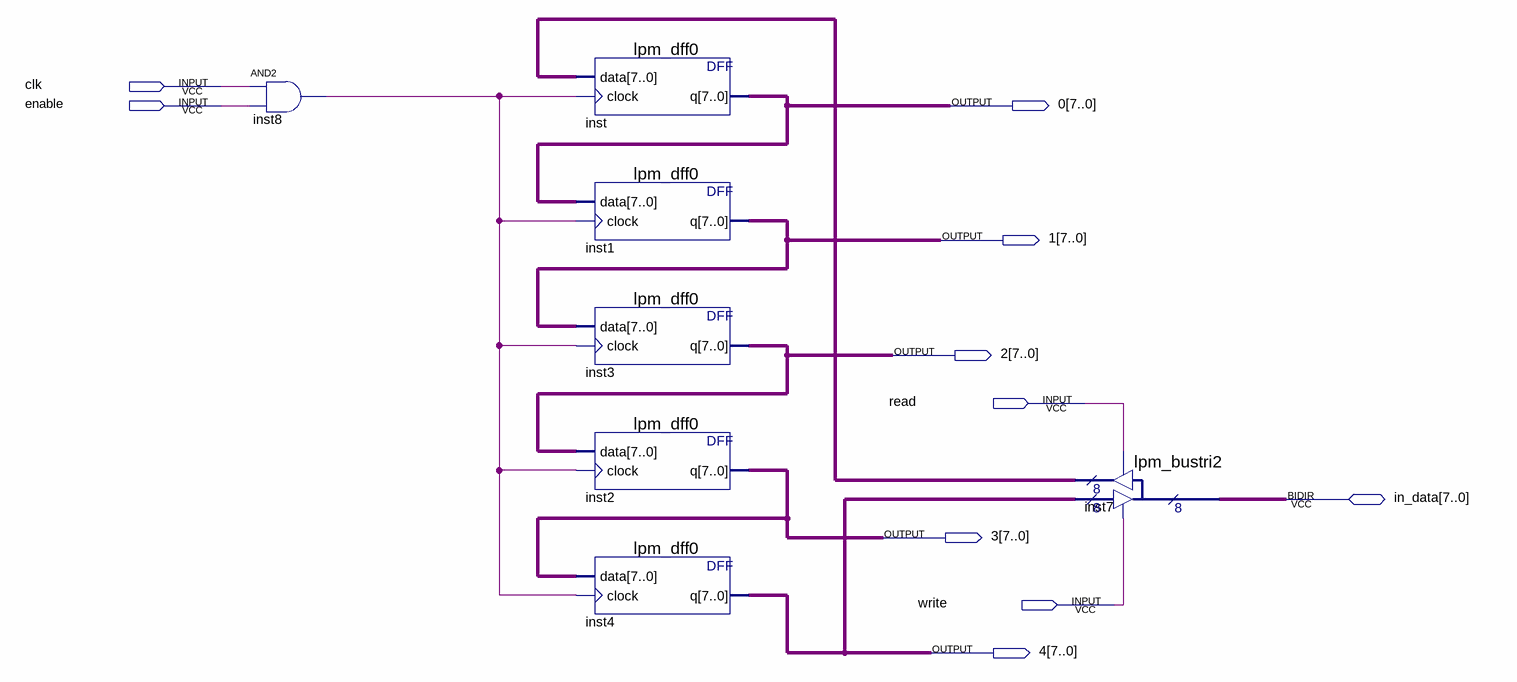
[diagram p0: schematic sheet]
// Quartus schematic buffer.bdf as structural Verilog: 7 symbols, 10 pins
module buffer (
  input  clk,
  input  enable,
  input  read,
  input  write,
  inout  [7:0] in_data,
  output [7:0] \0 ,
  output [7:0] \1 ,
  output [7:0] \2 ,
  output [7:0] \3 ,
  output [7:0] \4 
);

  wire inst8_out;
  wire [7:0] inst7_result;

  and inst8 (inst8_out, clk, enable);
  lpm_dff0 inst (.data(inst7_result), .clock(inst8_out), .q(\0 ));
  lpm_dff0 inst1 (.data(\0 ), .clock(inst8_out), .q(\1 ));
  lpm_dff0 inst3 (.data(\1 ), .clock(inst8_out), .q(\2 ));
  lpm_dff0 inst2 (.data(\2 ), .clock(inst8_out), .q(\3 ));
  lpm_dff0 inst4 (.data(\3 ), .clock(inst8_out), .q(\4 ));
  lpm_bustri2 inst7 (.enabledt(write), .data(\4 ), .enabletr(read), .result(inst7_result), .tridata(in_data));
endmodule
